# Altium schematic sheet 08_eMMC.SchDoc
size 297 x 209 mm
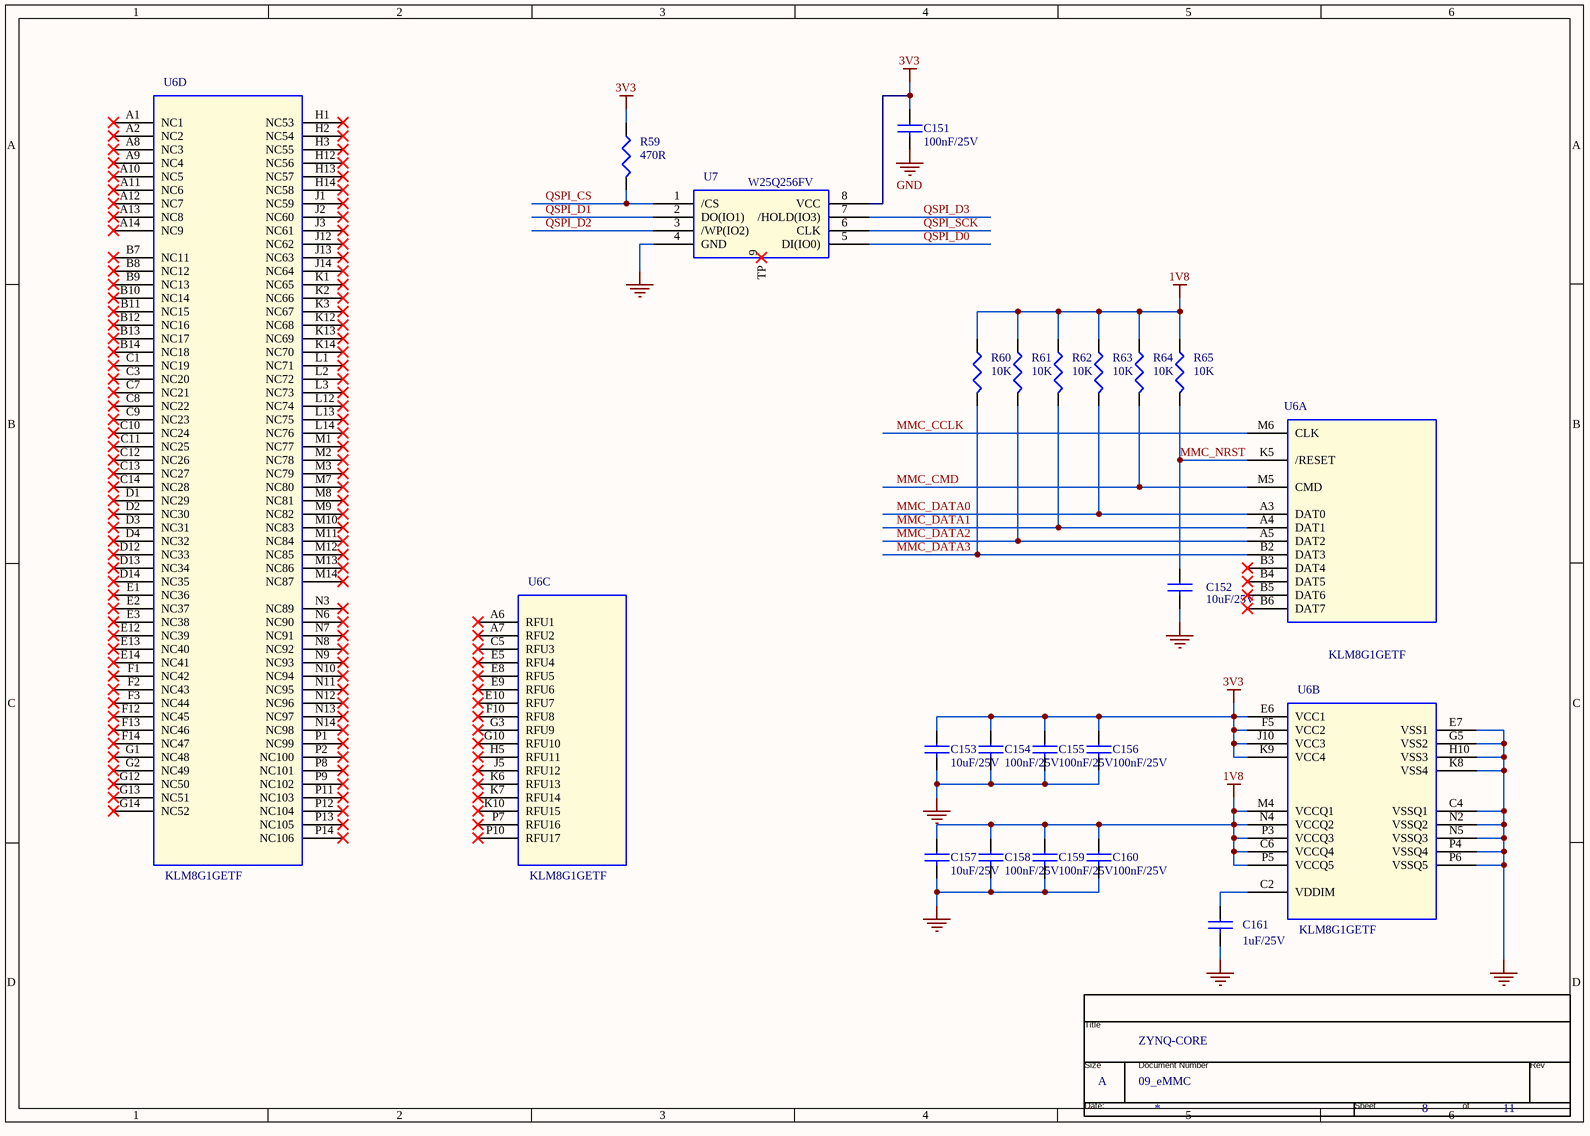
[diagram p0: 08_eMMC.SchDoc]

## Parts
*  Page Count: 11  Page Number: 8  Page Size: A  Title: ZYNQ-CORE  Doc: 09_eMMC  (hidden comment: TitleBlock0)  (graphical)
C151  100nF/25V  [C0402]
C152  10uF/25V  [C0603]
C153  10uF/25V  [C0603]
C154  100nF/25V  [C0402]
C155  100nF/25V  [C0402]
C156  100nF/25V  [C0402]
C157  10uF/25V  [C0603]
C158  100nF/25V  [C0402]
C159  100nF/25V  [C0402]
C160  100nF/25V  [C0402]
C161  1uF/25V  [C0402]
R59  470R  [R0402]
R60  10K  [R0402]
R61  10K  [R0402]
R62  10K  [R0402]
R63  10K  [R0402]
R64  10K  [R0402]
R65  10K  [R0402]
U6  KLM8G1GETF  [VFBGA]  (parts A,B,C,D of 4)
U7  W25Q256FV  [MLP8]

## Nets
1V8: C157.1 C158.1 C159.1 C160.1 R60.1 R61.1 R62.1 R63.1 R64.1 R65.1 U6.C6(VCCQ4) U6.M4(VCCQ1) U6.N4(VCCQ2) U6.P3(VCCQ3) U6.P5(VCCQ5)
3V3: C151.1 C153.1 C154.1 C155.1 C156.1 R59.1 U6.E6(VCC1) U6.F5(VCC2) U6.J10(VCC3) U6.K9(VCC4) U7.8(VCC)
GND: C151.2 C152.2 C153.2 C154.2 C155.2 C156.2 C157.2 C158.2 C159.2 C160.2 C161.2 U6.C4(VSSQ1) U6.E7(VSS1) U6.G5(VSS2) U6.H10(VSS3) U6.K8(VSS4) U6.N2(VSSQ2) U6.N5(VSSQ3) U6.P4(VSSQ4) U6.P6(VSSQ5) U7.4(GND)
MMC_CCLK: U6.M6(CLK)
MMC_CMD: R64.2 U6.M5(CMD)
MMC_DATA0: R63.2 U6.A3(DAT0)
MMC_DATA1: R62.2 U6.A4(DAT1)
MMC_DATA2: R61.2 U6.A5(DAT2)
MMC_DATA3: R60.2 U6.B2(DAT3)
MMC_NRST: C152.1 R65.2 U6.K5(/RESET)
QSPI_CS: R59.2 U7.1(/CS)
QSPI_D0: U7.5(DI(IO0))
QSPI_D1: U7.2(DO(IO1))
QSPI_D2: U7.3(/WP(IO2))
QSPI_D3: U7.7(/HOLD(IO3))
QSPI_SCK: U7.6(CLK)
NetC161_1: C161.1 U6.C2(VDDIM)

Not connected (* = marked no-connect by the designer): U6 A1(NC1)* A2(NC2)* A6(RFU1)* A7(RFU2)* A8(NC3)* A9(NC4)* A10(NC5)* A11(NC6)* A12(NC7)* A13(NC8)* A14(NC9)* B3(DAT4)* B4(DAT5)* B5(DAT6)* B6(DAT7)* B7(NC11)* B8(NC12)* B9(NC13)* B10(NC14)* B11(NC15)* B12(NC16)* B13(NC17)* B14(NC18)* C1(NC19)* C3(NC20)* C5(RFU3)* C7(NC21)* C8(NC22)* C9(NC23)* C10(NC24)* C11(NC25)* C12(NC26)* C13(NC27)* C14(NC28)* D1(NC29)* D2(NC30)* D3(NC31)* D4(NC32)* D12(NC33)* D13(NC34)* D14(NC35)* E1(NC36)* E2(NC37)* E3(NC38)* E5(RFU4)* E8(RFU5)* E9(RFU6)* E10(RFU7)* E12(NC39)* E13(NC40)* E14(NC41)* F1(NC42)* F2(NC43)* F3(NC44)* F10(RFU8)* F12(NC45)* F13(NC46)* F14(NC47)* G1(NC48)* G2(NC49)* G3(RFU9)* G10(RFU10)* G12(NC50)* G13(NC51)* G14(NC52)* H1(NC53)* H2(NC54)* H3(NC55)* H5(RFU11)* H12(NC56)* H13(NC57)* H14(NC58)* J1(NC59)* J2(NC60)* J3(NC61)* J5(RFU12)* J12(NC62)* J13(NC63)* J14(NC64)* K1(NC65)* K2(NC66)* K3(NC67)* K6(RFU13)* K7(RFU14)* K10(RFU15)* K12(NC68)* K13(NC69)* K14(NC70)* L1(NC71)* L2(NC72)* L3(NC73)* L12(NC74)* L13(NC75)* L14(NC76)* M1(NC77)* M2(NC78)* M3(NC79)* M7(NC80)* M8(NC81)* M9(NC82)* M10(NC83)* M11(NC84)* M12(NC85)* M13(NC86)* M14(NC87)* N3(NC89)* N6(NC90)* N7(NC91)* N8(NC92)* N9(NC93)* N10(NC94)* N11(NC95)* N12(NC96)* N13(NC97)* N14(NC98)* P1(NC99)* P2(NC100)* P7(RFU16)* P8(NC101)* P9(NC102)* P10(RFU17)* P11(NC103)* P12(NC104)* P13(NC105)* P14(NC106)*; U7 9(TP)*

## Notes on the sheet
- (in symbol TitleBlock0) Title; Size; Document Number; Rev; Date:; Sheet; of

## Library data of the parts
C151-C160 = CAP NP
  C151 C154-C156 C158-C160: PCB Footprint: C0402
  C152 C153 C157: PCB Footprint: C0603
C161 = CAP NP: PCB Footprint: C0603
R59-R65 = RESISTOR: PCB Footprint: R0402
U6 = MTFC4GACAAAM-1M_2: PCB Footprint: VFBGA
* = TitleBlock0: Page Create Date: March  8, 1995; Page Modify Date: *
U7 = W25Q256FV: PCB Footprint: MLP8